# Altium schematic sheet Sheet1_Therm.SchDoc
size A4; SheetNumber: 1; SheetTotal: 1
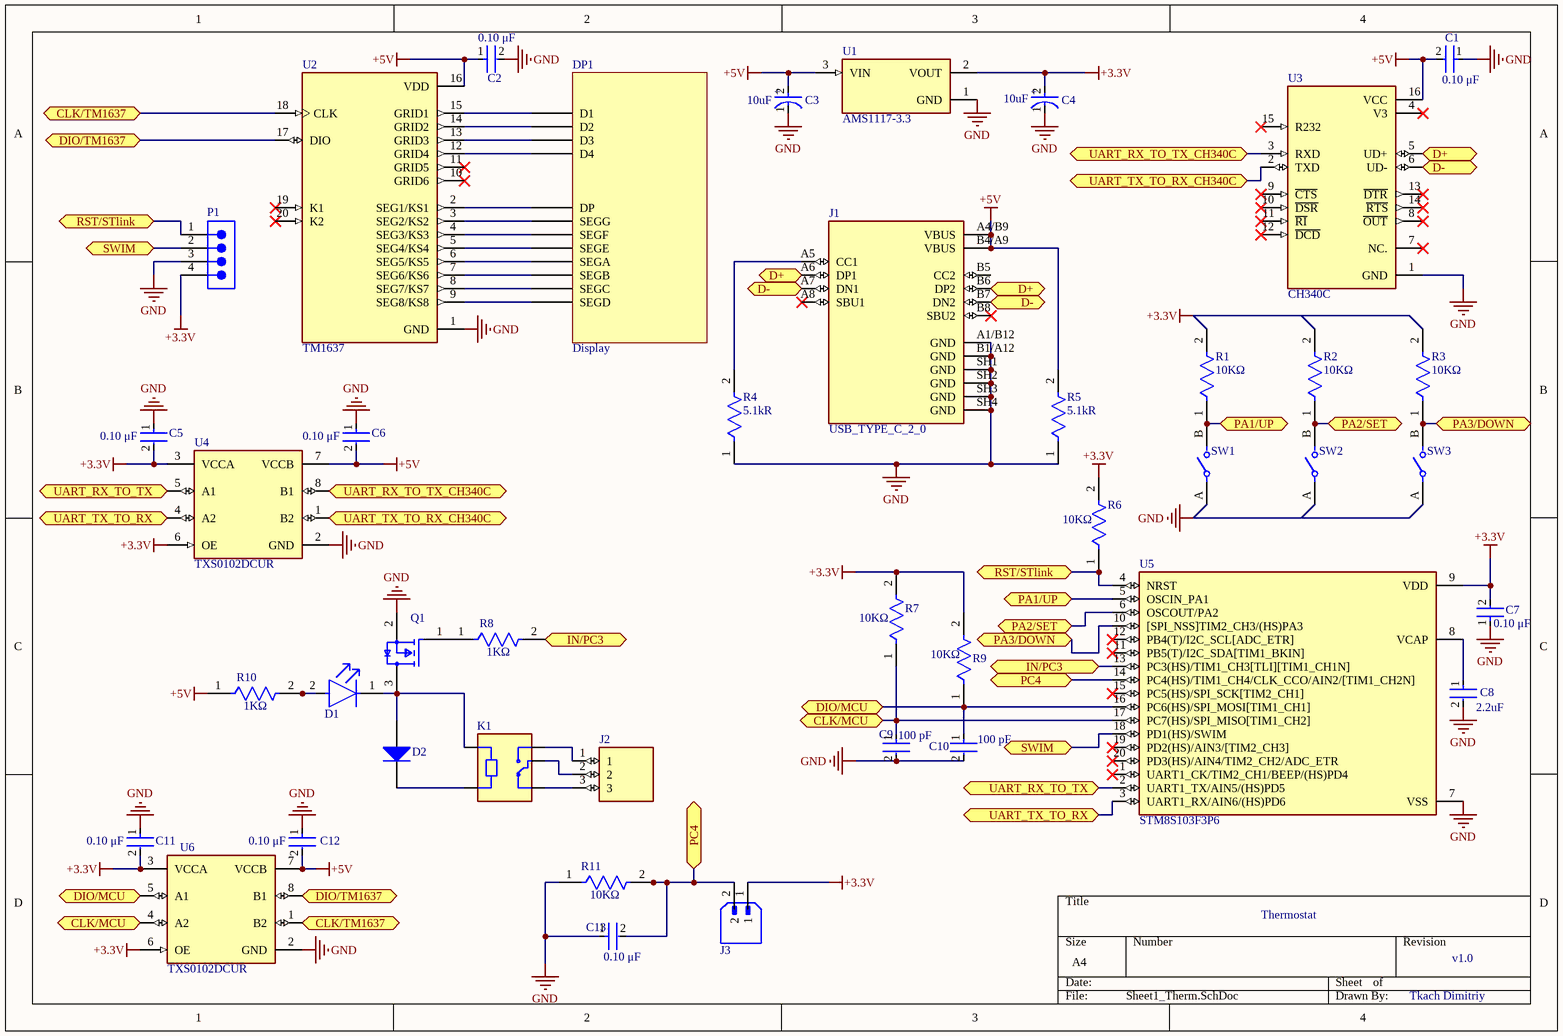
[diagram p0: Sheet1_Therm.SchDoc]

## Parts
C1  Capacitance: 0.10 μF  [FP-C1206C-EB-MFG]  (hidden comment: C1206C104K5RACAUTO)
C2  Capacitance: 0.10 μF  [FP-C1206C-EB-MFG]  (hidden comment: C1206C104K5RACAUTO)
C3  Capacitance: 10uF  [FP-T491A106K016AT-MFG]  (hidden comment: T491A106K016AT)
C4  Capacitance: 10uF  [FP-T491A106K016AT-MFG]  (hidden comment: T491A106K016AT)
C5  Capacitance: 0.10 μF  [FP-C1206C-EB-MFG]  (hidden comment: C1206C104K5RACAUTO)
C6  Capacitance: 0.10 μF  [FP-C1206C-EB-MFG]  (hidden comment: C1206C104K5RACAUTO)
C7  Capacitance: 0.10 μF  [FP-C1206C-EB-MFG]  (hidden comment: C1206C104K5RACAUTO)
C8  Capacitance: 2.2uF  [FP-C1206C225K5RACAUTO-MFG]  (hidden comment: C1206C225K5RACAUTO)
C9  Capacitance: 100 pF  [FP-C1206C-EB-MFG]  (hidden comment: C1206C101K5RACTU)
C10  Capacitance: 100 pF  [FP-C1206C-EB-MFG]  (hidden comment: C1206C101K5RACTU)
C11  Capacitance: 0.10 μF  [FP-C1206C-EB-MFG]  (hidden comment: C1206C104K5RACAUTO)
C12  Capacitance: 0.10 μF  [FP-C1206C-EB-MFG]  (hidden comment: C1206C104K5RACAUTO)
C13  Capacitance: 0.10 μF  [FP-C1206C-EB-MFG]  (hidden comment: C1206C104K5RACAUTO)
D1  LTST-C230KRKT  [FP-LTST-C230KRKT-MFG]  (value not drawn)
D2  1N4148W-7-F  [DIOD-SOD123-2_V]  (value not drawn)
DP1  Display  [CL3641AH]
J1  USB_TYPE_C_2_0  [USB Type-C 16Pin]
J2  39543-0603  [39543-0603]  (value not drawn)
J3  B2B-XH-A  [JST_B2B-XH-A]  (value not drawn)
K1  SRD-05VDC-SL-C  [RELAY_SRD-05VDC-SL-C]  (value not drawn)
P1  61300411021  [61300411021]  (value not drawn)
Q1  AO3400A  [FP-SOT23-MFG]  (value not drawn)
R1  Resistance: 10KΩ  [FP-CRGP1206-IPC_C]  (hidden comment: CRGP1206F10K)
R2  Resistance: 10KΩ  [FP-CRGP1206-IPC_C]  (hidden comment: CRGP1206F10K)
R3  Resistance: 10KΩ  [FP-CRGP1206-IPC_C]  (hidden comment: CRGP1206F10K)
R4  Resistance: 5.1kR  [FP-ESR18-IPC_A]  (hidden comment: ESR18EZPF5101)
R5  Resistance: 5.1kR  [FP-ESR18-IPC_A]  (hidden comment: ESR18EZPF5101)
R6  Resistance: 10KΩ  [FP-CRGP1206-IPC_C]  (hidden comment: CRGP1206F10K)
R7  Resistance: 10KΩ  [FP-CRGP1206-IPC_C]  (hidden comment: CRGP1206F10K)
R8  value 1KΩ  [FP-CRGCQ1206-IPC_C]  (hidden comment: CRGCQ1206F1K0)
R9  Resistance: 10KΩ  [FP-CRGP1206-IPC_C]  (hidden comment: CRGP1206F10K)
R10  value 1KΩ  [FP-CRGCQ1206-IPC_C]  (hidden comment: CRGCQ1206F1K0)
R11  Resistance: 10KΩ  [FP-CRGP1206-IPC_C]  (hidden comment: CRGP1206F10K)
SW1  EVQ-QJJ05Q  [FP-EVQ-QJJ05Q-MFG]  (value not drawn)
SW2  EVQ-QJJ05Q  [FP-EVQ-QJJ05Q-MFG]  (value not drawn)
SW3  EVQ-QJJ05Q  [FP-EVQ-QJJ05Q-MFG]  (value not drawn)
U1  AMS1117-3.3  [SOT229P700X180-4N]
U2  TM1637  [SOP65P640X120-20N]
U3  CH340C  [SOIC127P600X180-16N]
U4  TXS0102DCUR  [FP-DCU0008A-MFG]
U5  STM8S103F3P6  [SOP65P640X120-20N]
U6  TXS0102DCUR  [FP-DCU0008A-MFG]

## Ports
CLK/MCU (bidir, see Sheet1_Therm[1D]), CLK/MCU (bidir, see Sheet1_Therm[3C]), CLK/TM1637 (bidir, see Sheet1_Therm[1A]), CLK/TM1637 (bidir, see Sheet1_Therm[1D]), D+ (bidir, see Sheet1_Therm[2B], Sheet1_Therm[3B]), D+ (bidir, see Sheet1_Therm[2B], Sheet1_Therm[4A]), D+ (bidir, see Sheet1_Therm[3B], Sheet1_Therm[4A]), D- (bidir, see Sheet1_Therm[2B], Sheet1_Therm[3B]), D- (bidir, see Sheet1_Therm[2B], Sheet1_Therm[4A]), D- (bidir, see Sheet1_Therm[3B], Sheet1_Therm[4A]), DIO/MCU (bidir, see Sheet1_Therm[1D]), DIO/MCU (bidir, see Sheet1_Therm[3C]), DIO/TM1637 (bidir, see Sheet1_Therm[1A]), DIO/TM1637 (bidir, see Sheet1_Therm[1D]), IN/PC3 (bidir, see Sheet1_Therm[2C]), IN/PC3 (bidir, see Sheet1_Therm[3C]), PA1/UP (bidir, see Sheet1_Therm[3C]), PA1/UP (bidir, see Sheet1_Therm[4B]), PA2/SET (bidir, see Sheet1_Therm[3C]), PA2/SET (bidir, see Sheet1_Therm[4B]), PA3/DOWN (bidir, see Sheet1_Therm[3C]), PA3/DOWN (bidir, see Sheet1_Therm[4B]), PC4 (bidir, see Sheet1_Therm[2D]), PC4 (bidir, see Sheet1_Therm[3C]), RST/STlink (bidir, see Sheet1_Therm[1A]), RST/STlink (bidir, see Sheet1_Therm[3C]), SWIM (bidir, see Sheet1_Therm[1A]), SWIM (bidir, see Sheet1_Therm[3C]), UART_RX_TO_TX (bidir, see Sheet1_Therm[1B]), UART_RX_TO_TX (bidir, see Sheet1_Therm[3D]), UART_RX_TO_TX_CH340C (bidir, see Sheet1_Therm[1B]), UART_RX_TO_TX_CH340C (bidir, see Sheet1_Therm[3A]), UART_TX_TO_RX (bidir, see Sheet1_Therm[1C]), UART_TX_TO_RX (bidir, see Sheet1_Therm[3D]), UART_TX_TO_RX_CH340C (bidir, see Sheet1_Therm[1C]), UART_TX_TO_RX_CH340C (bidir, see Sheet1_Therm[3A])

## Nets
+3.3V: C4.2(A) C5.2 C7.2 C11.2 J3.1 P1.4 R6.2 R7.2 R9.2 U1.2(VOUT) U4.3(VCCA) U4.6(OE) U5.9(VDD) U6.3(VCCA) U6.6(OE)
+5V: C1.2 C2.1 C3.2(A) C6.2 C12.2 J1.A4/B9(VBUS) J1.B4/A9(VBUS) R5.2 R10.1 U1.3(VIN) U2.16(VDD) U3.16(VCC) U4.7(VCCB) U6.7(VCCB)
GND: C1.1 C2.2 C3.1(C) C4.1(C) C5.1 C6.1 C7.1 C8.2 C9.2 C10.2 C11.1 C12.1 C13.1 J1.A1/B12(GND) J1.B1/A12(GND) J1.SH1(GND) J1.SH2(GND) J1.SH3(GND) J1.SH4(GND) P1.3 Q1.2(S) R4.1 R5.1 R11.1 U1.1(GND) U2.1(GND) U3.1(GND) U4.2(GND) U5.7(VSS) U6.2(GND)
CLK/MCU: C9.1 R7.1 U5.17(PC7(HS)/SPI_MISO[TIM1_CH2]) U6.4(A2) ; port CLK/MCU
CLK/TM1637: U2.18(CLK) U6.1(B2) ; port CLK/TM1637
D+: J1.A6(DP1) J1.B6(DP2) U3.5(UD+) ; port D+
D-: J1.A7(DN1) J1.B7(DN2) U3.6(UD-) ; port D-
DIO/MCU: C10.1 R9.1 U5.16(PC6(HS)/SPI_MOSI[TIM1_CH1]) U6.5(A1) ; port DIO/MCU
DIO/TM1637: U2.17(DIO) U6.8(B1) ; port DIO/TM1637
IN/PC3: R8.2 U5.13(PC3(HS)/TIM1_CH3[TLI][TIM1_CH1N]) ; port IN/PC3
PA1/UP: R1.1 SW1.B U5.5(OSCIN_PA1) ; port PA1/UP
PA2/SET: R2.1 SW2.B U5.6(OSCOUT/PA2) ; port PA2/SET
PA3/DOWN: R3.1 SW3.B U5.10([SPI_NSS]TIM2_CH3/(HS)PA3) ; port PA3/DOWN
PC4: C13.2 J3.2 R11.2 U5.14(PC4(HS)/TIM1_CH4/CLK_CCO/AIN2/[TIM1_CH2N]) ; port PC4
RST/STlink: P1.1 R6.1 U5.4(NRST) ; port RST/STlink
SWIM: P1.2 U5.18(PD1(HS)/SWIM) ; port SWIM
UART_RX_TO_TX: U4.5(A1) U5.2(UART1_TX/AIN5/(HS)PD5) ; port UART_RX_TO_TX
UART_RX_TO_TX_CH340C: U3.3(RXD) U4.8(B1) ; port UART_RX_TO_TX_CH340C
UART_TX_TO_RX: U4.4(A2) U5.3(UART1_RX/AIN6/(HS)PD6) ; port UART_TX_TO_RX
UART_TX_TO_RX_CH340C: U3.2(TXD) U4.1(B2) ; port UART_TX_TO_RX_CH340C
NetC8_1: C8.1 U5.8(VCAP)
NetD1_1: D1.1(C) D2.1(A) K1.A1 Q1.3(D)
NetD1_2: D1.2(A) R10.2
NetD2_2: D2.2(K) K1.A2
NetDP1_D1: DP1.D1 U2.15(GRID1)
NetDP1_D2: DP1.D2 U2.14(GRID2)
NetDP1_D3: DP1.D3 U2.13(GRID3)
NetDP1_D4: DP1.D4 U2.12(GRID4)
NetDP1_DP: DP1.DP U2.2(SEG1/KS1)
NetDP1_SEGA: DP1.SEGA U2.6(SEG5/KS5)
NetDP1_SEGB: DP1.SEGB U2.7(SEG6/KS6)
NetDP1_SEGC: DP1.SEGC U2.8(SEG7/KS7)
NetDP1_SEGD: DP1.SEGD U2.9(SEG8/KS8)
NetDP1_SEGE: DP1.SEGE U2.5(SEG4/KS4)
NetDP1_SEGF: DP1.SEGF U2.4(SEG3/KS3)
NetDP1_SEGG: DP1.SEGG U2.3(SEG2/KS2)
NetJ1_A5: J1.A5(CC1) R4.2
NetJ2_1: J2.1 K1.NO
NetJ2_2: J2.2 K1.COM
NetJ2_3: J2.3 K1.NC
NetQ1_1: Q1.1(G) R8.1

Not connected (* = marked no-connect by the designer): J1 A8(SBU1)* B5(CC2) B8(SBU2)*; R1 2; R2 2; R3 2; SW1 A; SW2 A; SW3 A; U2 10(GRID6)* 11(GRID5)* 19(K1)* 20(K2)*; U3 4(V3)* 7(NC.)* 8(~{OUT})* 9(~{CTS})* 10(~{DSR})* 11(~{RI})* 12(~{DCD})* 13(~{DTR})* 14(~{RTS})* 15(R232)*; U5 1(UART1_CK/TIM2_CH1/BEEP/(HS)PD4)* 11(PB5(T)/I2C_SDA[TIM1_BKIN])* 12(PB4(T)/I2C_SCL[ADC_ETR])* 15(PC5(HS)/SPI_SCK[TIM2_CH1])* 19(PD2(HS)/AIN3/[TIM2_CH3])* 20(PD3(HS)/AIN4/TIM2_CH2/ADC_ETR)*

## Notes on the sheet
- Thermostat
- v1.0
- Tkach Dimitriy
- (in symbol CMP-2000-05173-2) +

## Library data of the parts
C1 C2 C5-C7 C11-C13 = CMP-03020-005759-1: CAP CER 0.1UF 50V X7R 1206; Manufacturer: KEMET; Temperature Coefficient: 15%; Value: 0.10 μF; Material: Ceramic; Automotive Grade: Grade 0; Tolerance: 0.1; RoHS: TRUE; Lead Free: Yes; ComponentLink2Description: Datasheet; Automotive: Yes; Temperature Characteristic: X7R; Temperature Range Low: -55°C; Voltage Rating: 50 V; Device Class L1: Passive Components; Ipc Land Pattern Name: CAPC320160X78; Mouser Description: Multilayer Ceramic Capacitors MLCC - SMD/SMT 0.1uF 50volts 10% X7R AUTO; Octopart: https://octopart.com/c1206c104k5racauto-kemet-12595586; Device Class L3: Ceramic Capacitors; Manufacturer Part Number: C1206C104K5RACAUTO; Digikey Description: CAP CER 0.1UF 50V X7R 1206; Temperature Range High: +150°C; Temperature: -55°C to +150°C; Device Class L2: Capacitors; ComponentLink2URL: https://content.kemet.com/datasheets/KEM_C1007_X8R_ULTRA_150C_SMD.pdf; Package: C1206C-EB; Category: Cap; Height: 0.88mm
C3 C4 = CMP-2000-05173-2: CAP TANT 10UF 10% 16V 1206; ESR (Equivalent Series Resistance): 7R; Polarity: Polar; Dielectric Material: Tantalum; Leakage Current: 1.6uA; Ripple Current: 104mA; Life (Hours): 2000Hour; Failure Rate: 0.001%; Depth: 1.6mm; Length: 3.2mm; REACH SVHC: No SVHC; Max Operating Temperature: 125°C; Features: General Purpose; Case Code (Imperial): 1206; Case Code (Metric): 3216; Dissipation Factor: 10%; Width: 1.6mm; Packaging: Tape and Reel; Termination: SMD/SMT; Voltage Rating (DC): 16V; Mount: Surface Mount; Voltage Rating: 16V; Min Operating Temperature: -55°C; Height: 1.6mm; Lead Free: Lead Free; Package Quantity: 1; Lead Pitch: 1.2mm; Number of Pins: 2; Height - Seated (Max): 0.071inch; Radiation Hardening: No; Voltage: 16V; RoHS Compliant: Yes; Case/Package: 1206; Tolerance: 10%
C8 = CMP-03020-034660-1: CAP CER 2.2UF 50V X7R 1206; Tolerance: 10%; Dielectric Material: Ceramic; Case Code (Metric): 3216; Voltage Rating (DC): 50V; Max Operating Temperature: 125°C; Voltage Rating: 50V; Construction: Flat; Package Quantity: 1; Width: 0.063inch; Radiation Hardening: No; Packaging: Tape and Reel; Ratings: AEC-Q200; Contact Plating: Tin; Dielectric: X7R; RoHS Compliant: Yes; Length: 3.2mm; Thickness: 0.071inch; Case/Package: 1206; Series: C; Depth: 1.6mm; REACH SVHC: No SVHC; Mount: Surface Mount; Height: 1.6mm; Termination: SMD/SMT; Case Code (Imperial): 1206; Min Operating Temperature: -55°C
C9 C10 = CMP-03020-017721-1: C1206 100 pF X7R 10.00% 50 V; Manufacturer: KEMET; Temperature Coefficient: 15%; Material: Ceramic; Value: 100 pF; Automotive Grade: Grade 0; Tolerance: 0.1; Voltage Rating: 50 V; RoHS: TRUE; Device Class L2: Capacitors; Automotive: Yes; Manufacturer Part Number: C1206C101K5RACTU; Temperature Range High: +150°C; Category: Cap; Device Class L1: Passive Components; Ipc Land Pattern Name: CAPC320160X78; Temperature: -55°C to +150°C; Temperature Range Low: -55°C; Package: C1206C-EB; ComponentLink2Description: Datasheet; Lead Free: Yes; Mouser Description: Cap Ceramic 100pF 50V X7R 10% SMD 1206 125°C Embossed Plastic T/R; Height: 0.88mm; Octopart: https://octopart.com/c1206c101k5ractu-kemet-67313462; Device Class L3: Ceramic Capacitors; Temperature Characteristic: X7R; ComponentLink2URL: https://content.kemet.com/datasheets/KEM_C1007_X8R_ULTRA_150C_SMD.pdf
D1 = CMP-22017-000041-1: LED RED CLEAR CHIP SMD; Dominant Wavelength: 631nm; Lens Color: Colorless; Lens Style: Diffused; Forward Voltage: 2V; Test Current: 20mA; Luminous Intensity: 54mcd; Number of LEDs: 1; Viewing Angle: 130°; Power Rating: 75mW; Forward Current: 30mA; Wavelength: 639nm; Reverse Voltage: 5V; Min Operating Temperature: -55°C; Height: 1.1mm; Length: 3.2mm; Lens Transparency: Clear; Case/Package: 1206; Package Quantity: 1; Width: 1.6mm; Max Operating Temperature: 85°C; Packaging: Tape and Reel; RoHS Compliant: Yes; Mount: Surface Mount; Lead Free: Lead Free; Depth: 1.6mm; Power Dissipation: 75mW; Number of Pins: 2; Number of Elements: 1; Color: Red; Illumination Color: Red; Case Code (Imperial): 1206; Case Code (Metric): 3216; Radiation Hardening: No
D2 = CMP-2000-04932-2: Fast Switching Diode, 100 V, 0.15 A, -65 to 150 degC, 2-Pin?SOD123, RoHS, Tape and Reel; Recovery Time: 4ns; Brand: DiodesIncorporated; Unit Weight: 0.000353oz; Max Surge Current: 2A; Peak Reverse Voltage: 100V; Ir - Reverse Current: 1uA; Vf - Forward Voltage: 1.25V; Configuration: Single; If - Forward Current: 0.15A; Product Category: Diodes-GeneralPurpose,Power,Switching; Operating Temperature Range: -65Cto+150C; Packaging: Reel; Manufacturer URL: http://www.diodes.com/; Maximum Operating Temperature: +150C; Height: 1.25mm; Minimum Operating Temperature: -65C; Product: SwitchingDiodes; Package URL: http://www.diodes.com/datasheets/ds18004.pdf; Type: SwitchingDiode; Package Reference: SOD123-2; Width: 1.7mm; Datasheet URL: http://www.farnell.com/datasheets/1915529.pdf; Datasheet Version: Rev. 24-2, 10/2013; Series: 1N4148; Factory Pack Quantity: 3000; Length: 2.85mm; RoHS: True; Manufacturer: DiodesIncorporated; Mounting Style: SMD/SMT; Package / Case: SOD-123
DP1 = Component_1_1
J1 = USB_CMP-002-00072-1: USB-C (USB TYPE-C) USB 2.0 Receptacle Connector 24 (16+8 Dummy) Position Surface Mount, Right Angle; MP: USB4110GFA; MF: Global Connector Technology; Check_prices: https://www.snapeda.com/parts/USB4110GFA/Global+Connector+Technology/view-part/?ref=eda; Design Item ID: USB4110GFA; Source: USB4110GFA.SchLib; Pins: 16; Component Type: Connectors; SnapEDA_Link: https://www.snapeda.com/parts/USB4110GFA/Global+Connector+Technology/view-part/?ref=snap; Value: *; Case/Package: None
J2 = CMP-037-000000-1: 3 Position Wire to Board Terminal Block Horizontal with Board 0.197 (5.00mm) Through Hole; MF: Molex; MP: 395430603; Component Type: Standard; SnapEDA_Link: https://www.snapeda.com/parts/395430603/Molex/view-part/?ref=snap; Package: None; Check_prices: https://www.snapeda.com/parts/395430603/Molex/view-part/?ref=eda; Value: *; Source: 39543-0603.SchLib; Design Item ID: 39543-0603; Pin Count: 3
J3 = CMP-033-000000-1: MF: {'manufacturer': u'JST Sales America Inc.'}; Pin Count: 2; Source: B2B-XH-A.SchLib; Availability: Unavailable; Design Item ID: B2B-XH-A; Component Type: Standard; Value: *; Price: None; Package: None; MP: B2B-XH-A
K1 = CMP-013-000000-1: 5V Trigger Relay Module For Arduino And Raspberry Pi 5V Trigger Relay Module For Arduino And Raspberry Pi; MF: Songle Relay; Source: SRD-05VDC-SL-C.SchLib; Check_prices: https://www.snapeda.com/parts/SRD-05VDC-SL-C/Songle+Relay/view-part/?ref=eda; Component Type: Standard; MP: SRD-05VDC-SL-C; SnapEDA_Link: https://www.snapeda.com/parts/SRD-05VDC-SL-C/Songle+Relay/view-part/?ref=snap; Price: None; Package: NON STANDARD-5 Songle Relay; Availability: Not in stock; Design Item ID: SRD-05VDC-SL-C; Value: *; Pin Count: 5
P1 = CMP-1502-01063-3: NexarPartId: 31153320; Current Rating: 3A; Number of Contacts: 4; Gender: Male; Operating Supply Voltage: 250V; Contact Resistance: 20mΩ; Connector Type: Male Pin; Pitch: 2.54mm; Contact Material: Copper; Number of Positions: 4; Color: Black; Contact Plating: Gold; Number of Pins: 4; Termination: Solder; Number of Rows: 1; Lead Pitch: 2.54mm; Mount: Through Hole; Contact Mating Length: 5.9944mm; RoHS: Compliant; REACH SVHC: Unknown
Q1 = CMP-83955-000006-1: MOSFET N-CH 30V 5.7A SOT23; Input Capacitance: 630pF; Number of Elements: 1; Rds On Max: 26.5mR; Max Power Dissipation: 1.4W; Gate to Source Voltage (Vgs): 12V; Min Operating Temperature: -55°C; Lead Free: Lead Free; Number of Pins: 3; Drain to Source Voltage (Vdss): 30V; Case/Package: SOT-23; Mount: Surface Mount; Continuous Drain Current (ID): 5.7A; Radiation Hardening: No; Packaging: Tape and Reel; Max Operating Temperature: 150°C; Power Dissipation: 1.4W
R1-R3 R6 R7 R9 R11 = CMP-03211-004788-1: CRGP 1206 10K 1%; Manufacturer: TE; Temperature Coefficient: ±100ppm/°C; Value: 10KΩ; Tolerance: 0.01; Power Rating: 0.5W; Voltage Rating: 200V; Package: CRGP1206; Ambient Temperature Range High: +70°C; Device Class L2: Resistors; Lead Free: Yes; Automotive: No; Series: CRGP; Temperature Range High: +155°C; Ipc Land Pattern Name: RESC310155X55; Device Class L1: Passive Components; Octopart: https://octopart.com/crgp1206f10k-te+connectivity-91018843; Temperature: -55°C to +155°C; Category: Res; Height: 0.65mm; Temperature Range Low: -55°C; RoHS: TRUE; Manufacturer Part Number: CRGP1206F10K; Digikey Description: CRGP 1206 10K 1%; Device Class L3: Chip SMD Resistors; Composition: Thick Film; ComponentLink2URL: https://www.mouser.com/datasheet/2/418/NG_DS_9-1773463-9_A-1358566.pdf; ComponentLink2Description: Datasheet
R4 R5 = CMP-08839-028234-1: 5.1kΩ ±1% 0.5W 1206 Anti-Surge Chip Resistor AEC-Q200; Temperature Coefficient: 100ppm/°C; Max Power Dissipation: 333mW; Resistor Type: Thick Film; Max Operating Temperature: 155°C; Min Operating Temperature: -55°C; Features: Automotive AEC-Q200; Height: 0.026inch; Length: 0.126inch; Packaging: Tape and Reel; Width: 0.063inch; Case/Package: 1206; Tolerance: 1%; Series: ESR18; Number of Terminations: 2; RoHS Compliant: Yes; Package Quantity: 5000
R8 R10 = CMP-03211-006592-1: CRGCQ1206 1KΩ 0.25W 1% ±100ppm/°C 200V; Manufacturer: TE Connectivity; Automotive Grade: Grade 685; Tolerance: 0.01; Ipc Land Pattern Name: RESC310155X55; Temperature Range Low: -55°C; Device Class L3: Chip SMD Resistors; ComponentLink2URL: https://www.te.com/commerce/DocumentDelivery/DDEController?Action=showdoc&DocId=Data+Sheet%7F1773204-3%7F1%7Fpdf%7FEnglish%7FENG_DS_1773204-3_1.pdf%7F4-2176347-694; Automotive: Yes; Temperature: -55°C to +155°C; Manufacturer Part Number: CRGCQ1206F1K0; Package: CRGCQ1206; Octopart: https://octopart.com/crgcq1206f1k0-te+connectivity-91018258; Device Class L1: Passive Components; Series: CRGCQ; Device Class L2: Resistors; RoHS: TRUE; Lead Free: Yes; ComponentLink2Description: Datasheet; Power Rating: 0.25W; Temperature Coefficient: ±100ppm/°C; Voltage Rating: 200V; Temperature Range High: +155°C; Height: 0.65mm; Category: Res; Resistance: 1KΩ; Composition: Thick Film; Ambient Temperature Range High: +70°C
SW1-SW3 = CMP-00287-56250562-1: EVQ-QJJ05Q Switch Tactile N.O. SPST Round Button PC Pins 0.005A 12VDC 0.8N Thru-Hole Radial T/R; Current Rating: 5mA; Life (Cycles): 1Mcycles; Switch Travel: 1mm; Illumination Type: Illuminated, Non-Illuminated; Operating Force: 800mN; Actuator Length: 1.5mm; Voltage Rating (DC): 12V; Contact Resistance: 200mΩ; Switch Function: Off-Mom; NexarPartId: 56250562; Contact Current Rating: 5mA; Radiation Hardening: No; Height: 5mm; Lead Free: Lead Free; Mechanical Life: 1Mcycles; REACH SVHC: No SVHC; RoHS: Compliant; Orientation: Straight; Case/Package: Axial; Contact Plating: Silver; Length: 8mm; Width: 8mm; Max Operating Temperature: 70°C; Max Voltage Rating (DC): 12V; Termination: PC Pin; Electrical Life: 1Mcycles; Throw Configuration: SPST; Mount: Through Hole; Packaging: Tape & Box (TB); Min Operating Temperature: -20°C
U1 = CMP-031-00006-2: Linear Voltage Regulator IC Positive Fixed 1 Output 1A SOT-223-3L; MF: UMW; SnapEDA_Link: https://www.snapeda.com/parts/AMS1117-3.3/UMW/view-part/?ref=snap; Value: *; Pins: 3; Source: AMS1117-3.3.SchLib; Check_prices: https://www.snapeda.com/parts/AMS1117-3.3/UMW/view-part/?ref=eda; MP: AMS1117-3.3; Case/Package: SOT-223-3L UMW; Design Item ID: AMS1117-3.3; Component Type: Standard
U2 = TM1637: LED Drive Control Special Circuit; MF: Titan Micro Electronics; SnapEDA_Link: https://www.snapeda.com/parts/TM1637/Titan+Micro+Electronics/view-part/?ref=snap; Package: None; Value: *; MP: TM1637; Check_prices: https://www.snapeda.com/parts/TM1637/Titan+Micro+Electronics/view-part/?ref=eda
U3 = CMP-019-000000-1: USB to serial chip CH340; MF: WCH; Component Type: Standard; Design Item ID: CH340C; Availability: Not in stock; MP: CH340C; Value: *; Source: CH340C.SchLib; SnapEDA_Link: https://www.snapeda.com/parts/CH340C/WCH/view-part/?ref=snap; Package: None; Pin Count: 16; Check_prices: https://www.snapeda.com/parts/CH340C/WCH/view-part/?ref=eda; Price: None
U4 U6 = CMP-0859-00001-2: IC TRNSLTR BIDIRECTIONAL US8; Manufacturer: Texas Instruments; Number Of Circuits: 1; Number Of Inputs: 2; Data Rate: 24Mbits/s; Max Junction Temp: +150°C; V A Min: 1.65V; Standoff Height: 0mm; Logic Function Desc: Bidirectional Voltage-Level Translator; Max Supply Voltage: 5.5V; V A Max: 3.6V; Nominal Supply Current: 1-14.4uA; V B Min: 2.3V; Temperature: -40°C to +85°C; Temperature Range Low: -40°C; Height: 0.9mm; Device Class L1: Integrated Circuits (ICs); RoHS: TRUE; Min Supply Voltage: 1.65V; Digikey Description: IC TRNSLTR BIDIRECTIONAL US8; ComponentLink2Description: Datasheet; Octopart: https://octopart.com/txs0102dcur-texas+instruments-5414308; Temperature Range High: +85°C; Device Class L2: Logic ICs; Category: IC; Ambient Temperature Range High: +85°C; Automotive: No; Manufacturer Part Number: TXS0102DCUR; Device Class L3: Voltage Level Shifters; Number Of Outputs: 2; Ambient Temperature Range Low: -40°C; Lead Free: Yes; ComponentLink2URL: http://www.ti.com/lit/ds/symlink/txs0102.pdf; V B Max: 5.5V; Package: DCU0008A; Mouser Description: Translation - Voltage Levels 2-Bit Bi-Directional Voltage-Level-Trans
U5 = STM8S103F3P6: STM8 series Microcontroller IC 8-Bit 16MHz 8KB (8K x 8) FLASH 20-TSSOP; MF: STMicroelectronics; SnapEDA_Link: https://www.snapeda.com/parts/STM8S103F3P6/STMicroelectronics/view-part/?ref=snap; Package: TSSOP-20 STMicroelectronics; Value: *; MP: STM8S103F3P6; Check_prices: https://www.snapeda.com/parts/STM8S103F3P6/STMicroelectronics/view-part/?ref=eda